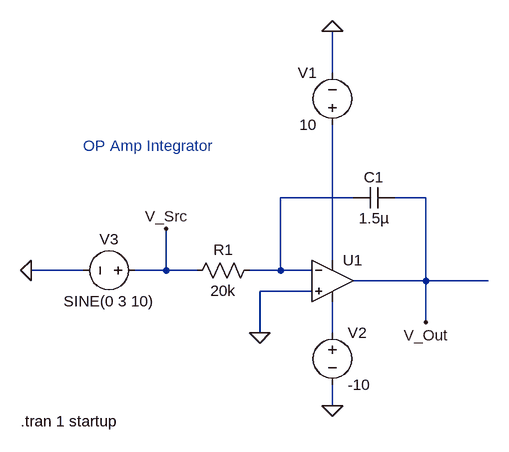
[diagram p0: schematic OP_Amp_Integrator.asc]
OP_Amp_Integrator.asc, the LTspice schematic file:
Version 4.1
SHEET 1 880 680
WIRE 160 -160 160 -224
WIRE 192 32 80 32
WIRE 304 32 256 32
WIRE 160 128 160 -80
WIRE -224 144 -304 144
WIRE -96 144 -96 80
WIRE -96 144 -144 144
WIRE -48 144 -96 144
WIRE 80 144 80 32
WIRE 80 144 32 144
WIRE 128 144 80 144
WIRE 304 160 304 32
WIRE 304 160 192 160
WIRE 400 160 304 160
WIRE 128 176 48 176
WIRE 304 224 304 160
WIRE 48 240 48 176
WIRE 160 240 160 192
WIRE 160 352 160 320
FLAG 160 352 0
FLAG 160 -224 0
FLAG 48 240 0
FLAG -304 144 0
FLAG -96 80 V_Src
FLAG 304 224 V_Out
SYMBOL OpAmps\\UniversalOpAmp2 160 160 R0
SYMATTR InstName U1
SYMBOL voltage 160 224 R0
WINDOW 123 0 0 Left 0
WINDOW 39 0 0 Left 0
SYMATTR InstName V2
SYMATTR Value -10
SYMBOL voltage -128 144 R90
WINDOW 0 -32 56 VBottom 2
WINDOW 3 32 56 VTop 2
WINDOW 123 0 0 Left 0
WINDOW 39 0 0 Left 0
SYMATTR InstName V3
SYMATTR Value SINE(0 3 10)
SYMBOL voltage 160 -64 R180
WINDOW 0 24 96 Left 2
WINDOW 3 24 16 Left 2
WINDOW 123 0 0 Left 0
WINDOW 39 0 0 Left 0
SYMATTR InstName V1
SYMATTR Value 10
SYMBOL res 48 128 R90
WINDOW 0 0 56 VBottom 2
WINDOW 3 32 56 VTop 2
SYMATTR InstName R1
SYMATTR Value 20k
SYMBOL cap 256 16 R90
WINDOW 0 0 32 VBottom 2
WINDOW 3 32 32 VTop 2
SYMATTR InstName C1
SYMATTR Value 1.5µ
TEXT -320 376 Left 2 !.tran 1 startup
TEXT -224 -48 Left 2 ;OP Amp Integrator

The netlist it stands for:
* OP_Amp_Integrator.asc
X§U1 0 N001 N002 N003 V_Out level2 Avol=1Meg GBW=10Meg Slew=10Meg Ilimit=25m Rail=0 Vos=0 En=0 Enk=0 In=0 Ink=0 Rin=500Meg  ; pins In+ In- V+ V- OUT
V2 N003 0 -10
V3 V_Src 0 SINE(0 3 10)
V1 N002 0 10
R1 N001 V_Src 20k
C1 V_Out N001 1.5µ
.tran 1 startup
* OP Amp Integrator
.lib UniversalOpAmp2.lib
.backanno
.end